# Altium project PCB_Project_Koruza_expander_board_Altium.PrjPcb
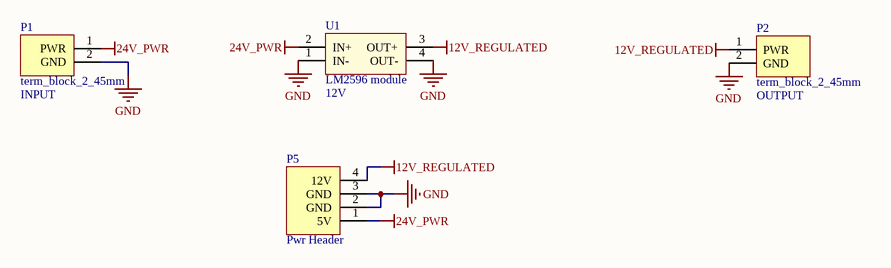
[diagram p0: Sheet1_PWR_connectors.SchDoc]
4 sheets, 70 parts. Net scope: flat (ports and power ports of the same name join across sheets).
Board file: PCB_Koruza_expander_board.PcbDoc
Sheets:
  Sheet1_PWR_connectors.SchDoc
  Sheet2_WITI_Board_USB.SchDoc
  Sheet3_IR.SchDoc
  Sheet4_SFP_StepperDriver.SchDoc

## Sheet Sheet1_PWR_connectors.SchDoc: Koruza Expander Board
size A4; Date: 12.7.2016; Author: Matej Gomboc; CompanyName: Institute IRNAS Rače; Revision: 1.0; SheetNumber: 1; SheetTotal: 4; CurrentDate: 12.7.2016

### Parts
P1  term_block_2_45mm  Direction: INPUT  [term_block_2_45mm]
P2  term_block_2_45mm  Direction: OUTPUT  [term_block_2_45mm]
P5  Pwr Header  [HDR1X4_CONN]
U1  LM2596 module  value 12V  [LM2596 module]

### Nets
12V_REGULATED: P2.1(PWR) P5.4(12V) U1.3(OUT+)
24V_PWR: P1.1(PWR) P5.1(5V) U1.2(IN+)
GND: P1.2(GND) P2.2(GND) P5.2(GND) P5.3(GND) U1.1(IN-) U1.4(OUT-)

### Library data of the parts
P1 P2 = term_block_2_45mm: terminal block, 2.45mm
P5 = 1x4_pwr_header: 1X4 Pwr Header

## Sheet Sheet2_WITI_Board_USB.SchDoc: Koruza Expander Board
size A4; Date: 12.7.2016; Author: Matej Gomboc; CompanyName: Institute IRNAS Rače; Revision: 1.0; SheetNumber: 2; SheetTotal: 4; CurrentDate: 12.7.2016
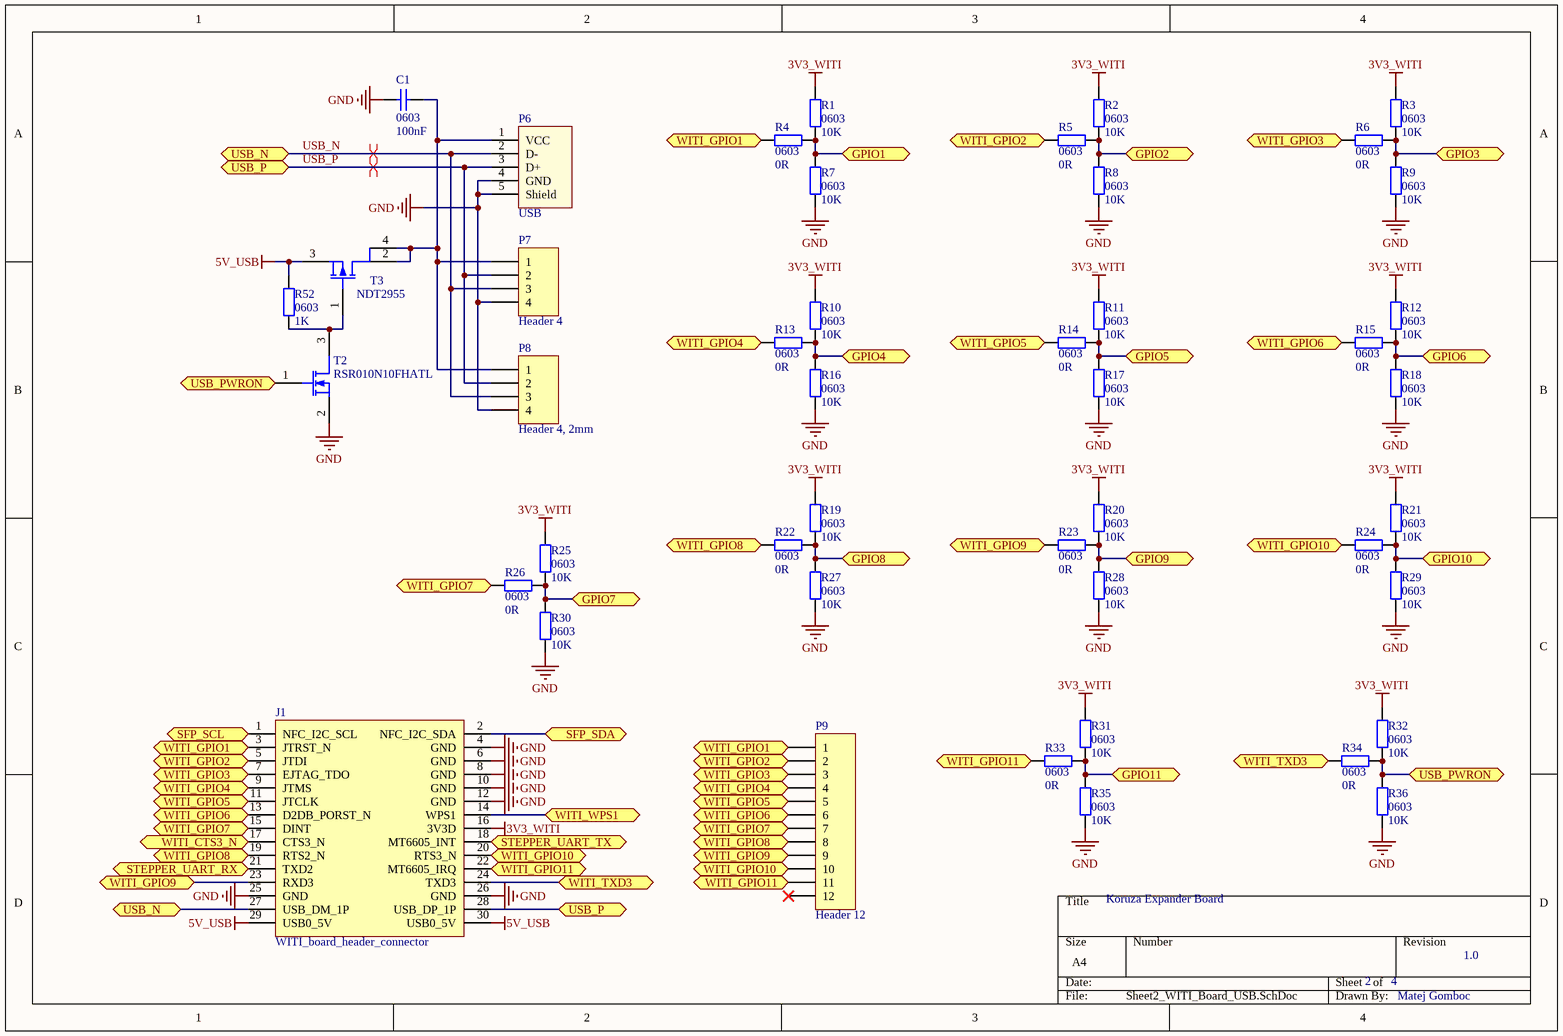
[diagram p1: Sheet2_WITI_Board_USB.SchDoc]

### Parts
C1  0603  value 100nF  [0603_HandSoldering]
J1  WITI_board_header_connector  [HDR2X15]
P6  USB  [USB A THT]
P7  Header 4  [HDR1X4]
P8  Header 4, 2mm  [HDR1X4_2mm]
P9  Header 12  [HDR1X12]
R1  0603  value 10K  [0603_HandSoldering]
R2  0603  value 10K  [0603_HandSoldering]
R3  0603  value 10K  [0603_HandSoldering]
R4  0603  value 0R  [0603_HandSoldering]
R5  0603  value 0R  [0603_HandSoldering]
R6  0603  value 0R  [0603_HandSoldering]
R7  0603  value 10K  [0603_HandSoldering]
R8  0603  value 10K  [0603_HandSoldering]
R9  0603  value 10K  [0603_HandSoldering]
R10  0603  value 10K  [0603_HandSoldering]
R11  0603  value 10K  [0603_HandSoldering]
R12  0603  value 10K  [0603_HandSoldering]
R13  0603  value 0R  [0603_HandSoldering]
R14  0603  value 0R  [0603_HandSoldering]
R15  0603  value 0R  [0603_HandSoldering]
R16  0603  value 10K  [0603_HandSoldering]
R17  0603  value 10K  [0603_HandSoldering]
R18  0603  value 10K  [0603_HandSoldering]
R19  0603  value 10K  [0603_HandSoldering]
R20  0603  value 10K  [0603_HandSoldering]
R21  0603  value 10K  [0603_HandSoldering]
R22  0603  value 0R  [0603_HandSoldering]
R23  0603  value 0R  [0603_HandSoldering]
R24  0603  value 0R  [0603_HandSoldering]
R25  0603  value 10K  [0603_HandSoldering]
R26  0603  value 0R  [0603_HandSoldering]
R27  0603  value 10K  [0603_HandSoldering]
R28  0603  value 10K  [0603_HandSoldering]
R29  0603  value 10K  [0603_HandSoldering]
R30  0603  value 10K  [0603_HandSoldering]
R31  0603  value 10K  [0603_HandSoldering]
R32  0603  value 10K  [0603_HandSoldering]
R33  0603  value 0R  [0603_HandSoldering]
R34  0603  value 0R  [0603_HandSoldering]
R35  0603  value 10K  [0603_HandSoldering]
R36  0603  value 10K  [0603_HandSoldering]
R52  0603  value 1K  [0603_HandSoldering]
T2  RSR010N10FHATL  [SOT23-3]
T3  NDT2955  [SOT230P700X180-4N]

### Ports
GPIO1, GPIO2, GPIO3, GPIO4, GPIO5, GPIO6, GPIO7, GPIO8, GPIO9, GPIO10, GPIO11, SFP_SCL, SFP_SDA, STEPPER_UART_RX, STEPPER_UART_TX, USB_N, USB_P, USB_PWRON, WITI_CTS3_N, WITI_GPIO1, WITI_GPIO2, WITI_GPIO3, WITI_GPIO4, WITI_GPIO5, WITI_GPIO6, WITI_GPIO7, WITI_GPIO8, WITI_GPIO9, WITI_GPIO10, WITI_GPIO11, WITI_TXD3, WITI_WPS1

### Nets
3V3_WITI: J1.16(3V3D) R1.2 R2.2 R3.2 R10.2 R11.2 R12.2 R19.2 R20.2 R21.2 R25.2 R31.2 R32.2
5V_USB: J1.29(USB0_5V) J1.30(USB0_5V) R52.2 T3.3(S)
GND: C1.1 J1.4(GND) J1.6(GND) J1.8(GND) J1.10(GND) J1.12(GND) J1.25(GND) J1.26(GND) P6.4(GND) P6.5(Shield) P7.4 P8.4 R7.1 R8.1 R9.1 R16.1 R17.1 R18.1 R27.1 R28.1 R29.1 R30.1 R35.1 R36.1 T2.2(S)
USB_N: J1.27(USB_DM_1P) P6.2(D-) P7.3 P8.3 ; port USB_N
USB_P: J1.28(USB_DP_1P) P6.3(D+) P7.2 P8.2 ; port USB_P
NetC1_2: C1.2 P6.1(VCC) P7.1 P8.1 T3.2(D) T3.4(D)
NetJ1_1: J1.1(NFC_I2C_SCL) ; port SFP_SCL
NetJ1_2: J1.2(NFC_I2C_SDA) ; port SFP_SDA
NetJ1_3: J1.3(JTRST_N) P9.1 R4.1 ; port WITI_GPIO1
NetJ1_5: J1.5(JTDI) P9.2 R5.1 ; port WITI_GPIO2
NetJ1_7: J1.7(EJTAG_TDO) P9.3 R6.1 ; port WITI_GPIO3
NetJ1_9: J1.9(JTMS) P9.4 R13.1 ; port WITI_GPIO4
NetJ1_11: J1.11(JTCLK) P9.5 R14.1 ; port WITI_GPIO5
NetJ1_13: J1.13(D2DB_PORST_N) P9.6 R15.1 ; port WITI_GPIO6
NetJ1_14: J1.14(WPS1) ; port WITI_WPS1
NetJ1_15: J1.15(DINT) P9.7 R26.1 ; port WITI_GPIO7
NetJ1_17: J1.17(CTS3_N) ; port WITI_CTS3_N
NetJ1_18: J1.18(MT6605_INT) ; port STEPPER_UART_TX
NetJ1_19: J1.19(RTS2_N) P9.8 R22.1 ; port WITI_GPIO8
NetJ1_20: J1.20(RTS3_N) P9.10 R24.1 ; port WITI_GPIO10
NetJ1_21: J1.21(TXD2) ; port STEPPER_UART_RX
NetJ1_22: J1.22(MT6605_IRQ) P9.11 R33.1 ; port WITI_GPIO11
NetJ1_23: J1.23(RXD3) P9.9 R23.1 ; port WITI_GPIO9
NetJ1_24: J1.24(TXD3) R34.1 ; port WITI_TXD3
NetR1_1: R1.1 R4.2 R7.2 ; port GPIO1
NetR2_1: R2.1 R5.2 R8.2 ; port GPIO2
NetR3_1: R3.1 R6.2 R9.2 ; port GPIO3
NetR10_1: R10.1 R13.2 R16.2 ; port GPIO4
NetR11_1: R11.1 R14.2 R17.2 ; port GPIO5
NetR12_1: R12.1 R15.2 R18.2 ; port GPIO6
NetR19_1: R19.1 R22.2 R27.2 ; port GPIO8
NetR20_1: R20.1 R23.2 R28.2 ; port GPIO9
NetR21_1: R21.1 R24.2 R29.2 ; port GPIO10
NetR25_1: R25.1 R26.2 R30.2 ; port GPIO7
NetR31_1: R31.1 R33.2 R35.2 ; port GPIO11
NetR32_1: R32.1 R34.2 R36.2 T2.1(G) ; port USB_PWRON
NetR52_1: R52.1 T2.3(D) T3.1(G)

Not connected (* = marked no-connect by the designer): P9 12*

### Layout directives
differential pair: USB_N, USB_P

### Library data of the parts
C1 = capacitor_ceramic: Ceramic Capacitor
J1 = WITI_board_header_connector: WITI board header connector
P6 = USB: USB A standard receptacle
P7 = Header 4: Header, 4-Pin
P8 = Header 4 - 2mm: Header, 4-Pin, 2mm
P9 = Header 12: Header, 12-Pin
R1-R36 R52 = resistor
T2 = RSR010N10FHATL: N MOSFET
T3 = NDT2955: P MOSFET

## Sheet Sheet3_IR.SchDoc: Koruza Expander Board
size A4; Date: 12.7.2016; Author: Matej Gomboc; CompanyName: Institute IRNAS Rače; Revision: 1.0; SheetNumber: 3; SheetTotal: 4; CurrentDate: 12.7.2016
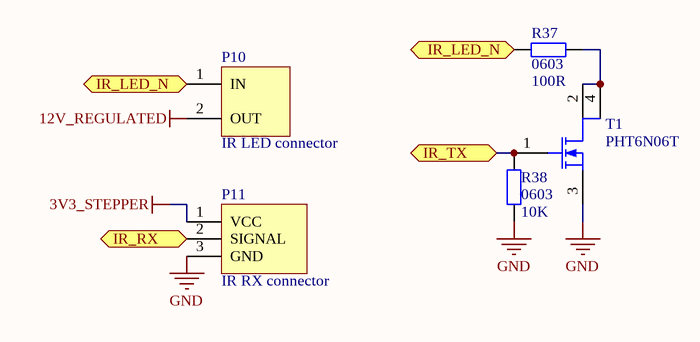
[diagram p2: Sheet3_IR.SchDoc]

### Parts
P10  IR LED connector  [term_block_2_45mm]
P11  IR RX connector  [term_block_3pole_2_45mm]
R37  0603  value 100R  [0603_HandSoldering]
R38  0603  value 10K  [0603_HandSoldering]
T1  PHT6N06T  [SOT230P700X180-4N]

### Ports
IR_LED_N, IR_RX, IR_TX

### Nets
3V3_STEPPER: P11.1(VCC)
12V_REGULATED: P10.2(OUT)
GND: P11.3(GND) R38.1 T1.3(S)
NetP10_1: P10.1(IN) R37.2 ; port IR_LED_N
NetP11_2: P11.2(SIGNAL) ; port IR_RX
NetR37_1: R37.1 T1.2(D) T1.4(D)
NetR38_2: R38.2 T1.1(G) ; port IR_TX

### Library data of the parts
P10 = IR_LED_connector
P11 = IR_RX_connector
R37 R38 = resistor
T1 = PHT6N06T: N MOSFET

## Sheet Sheet4_SFP_StepperDriver.SchDoc: Koruza Expander Board
size A4; Date: 12.7.2016; Author: Matej Gomboc; CompanyName: Institute IRNAS Rače; Revision: 1.0; SheetNumber: 4; SheetTotal: 4; CurrentDate: 12.7.2016
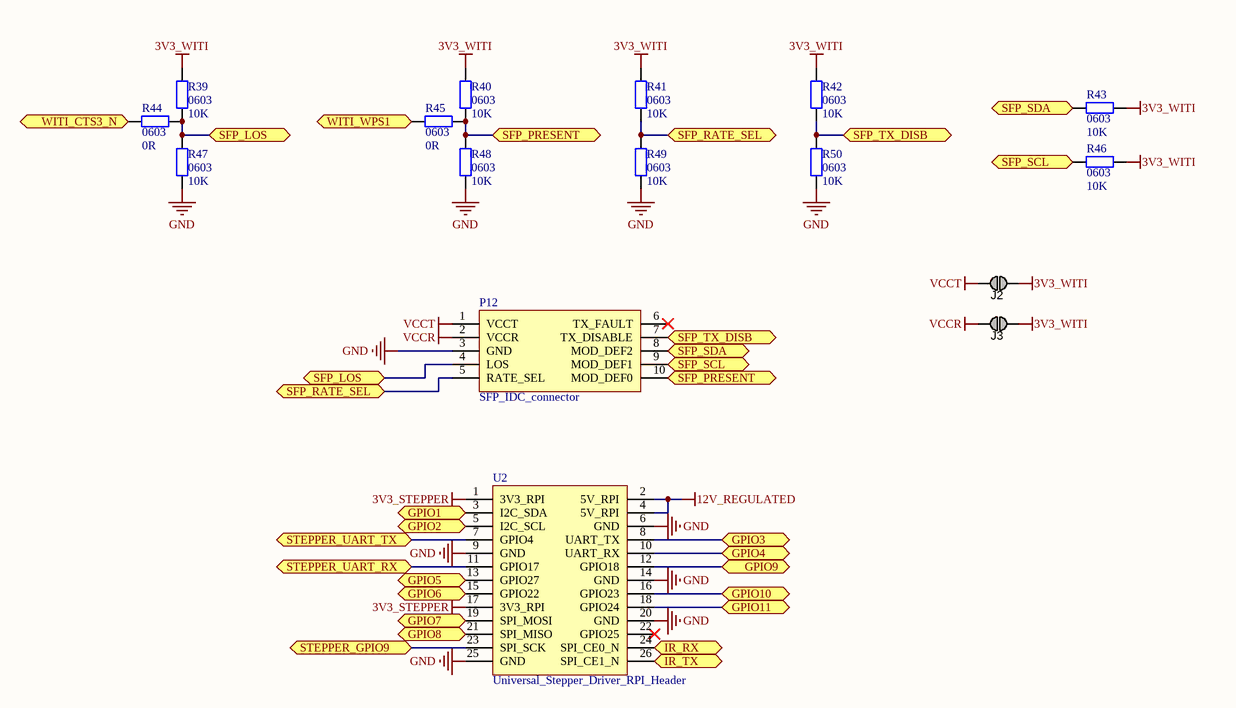
[diagram p3: Sheet4_SFP_StepperDriver.SchDoc]

### Parts
J2  Jumper  [JUMP1]  (value not drawn)  (no BOM)
J3  Jumper  [JUMP1]  (value not drawn)  (no BOM)
P12  SFP_IDC_connector  [IDC10]
R39  0603  value 10K  [0603_HandSoldering]
R40  0603  value 10K  [0603_HandSoldering]
R41  0603  value 10K  [0603_HandSoldering]
R42  0603  value 10K  [0603_HandSoldering]
R43  0603  value 10K  [0603_HandSoldering]
R44  0603  value 0R  [0603_HandSoldering]
R45  0603  value 0R  [0603_HandSoldering]
R46  0603  value 10K  [0603_HandSoldering]
R47  0603  value 10K  [0603_HandSoldering]
R48  0603  value 10K  [0603_HandSoldering]
R49  0603  value 10K  [0603_HandSoldering]
R50  0603  value 10K  [0603_HandSoldering]
U2  Universal_Stepper_Driver_RPI_Header  [Universal_Stepper_Driver_board]

### Ports
GPIO1, GPIO2, GPIO3, GPIO4, GPIO5, GPIO6, GPIO7, GPIO8, GPIO9, GPIO10, GPIO11, IR_RX, IR_TX, SFP_LOS, SFP_PRESENT, SFP_RATE_SEL, SFP_SCL, SFP_SDA, SFP_TX_DISB, STEPPER_GPIO9, STEPPER_UART_RX, STEPPER_UART_TX, WITI_CTS3_N, WITI_WPS1

### Nets
3V3_STEPPER: U2.1(3V3_RPI) U2.17(3V3_RPI)
3V3_WITI: J2.1 J3.2 R39.2 R40.2 R41.2 R42.2 R43.1 R46.1
12V_REGULATED: U2.2(5V_RPI) U2.4(5V_RPI)
GND: P12.3(GND) R47.1 R48.1 R49.1 R50.1 U2.6(GND) U2.9(GND) U2.14(GND) U2.20(GND) U2.25(GND)
VCCR: J3.1 P12.2(VCCR)
VCCT: J2.2 P12.1(VCCT)
NetJ1_1: P12.9(MOD_DEF1) R46.2 ; port SFP_SCL
NetJ1_2: P12.8(MOD_DEF2) R43.2 ; port SFP_SDA
NetJ1_14: R45.1 ; port WITI_WPS1
NetJ1_17: R44.1 ; port WITI_CTS3_N
NetJ1_18: U2.7(GPIO4) ; port STEPPER_UART_TX
NetJ1_21: U2.11(GPIO17) ; port STEPPER_UART_RX
NetP11_2: U2.24(SPI_CE0_N) ; port IR_RX
NetP12_4: P12.4(LOS) R39.1 R44.2 R47.2 ; port SFP_LOS
NetP12_5: P12.5(RATE_SEL) R41.1 R49.2 ; port SFP_RATE_SEL
NetP12_7: P12.7(TX_DISABLE) R42.1 R50.2 ; port SFP_TX_DISB
NetP12_10: P12.10(MOD_DEF0) R40.1 R45.2 R48.2 ; port SFP_PRESENT
NetR1_1: U2.3(I2C_SDA) ; port GPIO1
NetR2_1: U2.5(I2C_SCL) ; port GPIO2
NetR3_1: U2.8(UART_TX) ; port GPIO3
NetR10_1: U2.10(UART_RX) ; port GPIO4
NetR11_1: U2.13(GPIO27) ; port GPIO5
NetR12_1: U2.15(GPIO22) ; port GPIO6
NetR19_1: U2.21(SPI_MISO) ; port GPIO8
NetR20_1: U2.12(GPIO18) ; port GPIO9
NetR21_1: U2.16(GPIO23) ; port GPIO10
NetR25_1: U2.19(SPI_MOSI) ; port GPIO7
NetR31_1: U2.18(GPIO24) ; port GPIO11
NetR38_2: U2.26(SPI_CE1_N) ; port IR_TX
NetU2_23: U2.23(SPI_SCK) ; port STEPPER_GPIO9

Not connected (* = marked no-connect by the designer): P12 6(TX_FAULT)*; U2 22(GPIO25)*

### Library data of the parts
J2 J3 = JUMP1: SMD jumper
P12 = SFP_IDC_connector: SFP IDC10 connector
R39-R50 = resistor
U2 = Universal_Stepper_Driver: Universal Stepper Driver Raspberry PI Header

## Nets that join several sheets
3V3_STEPPER: Sheet3_IR (P11.1), Sheet4_SFP_StepperDriver (U2.1 U2.17)
3V3_WITI: Sheet2_WITI_Board_USB (13 pins), Sheet4_SFP_StepperDriver (8 pins)
12V_REGULATED: Sheet1_PWR_connectors (P2.1 P5.4 U1.3), Sheet3_IR (P10.2), Sheet4_SFP_StepperDriver (U2.2 U2.4)
GND: Sheet1_PWR_connectors (6 pins), Sheet2_WITI_Board_USB (25 pins), Sheet3_IR (P11.3 R38.1 T1.3), Sheet4_SFP_StepperDriver (10 pins)
NetJ1_1: Sheet2_WITI_Board_USB (J1.1), Sheet4_SFP_StepperDriver (P12.9 R46.2)
NetJ1_2: Sheet2_WITI_Board_USB (J1.2), Sheet4_SFP_StepperDriver (P12.8 R43.2)
NetJ1_14: Sheet2_WITI_Board_USB (J1.14), Sheet4_SFP_StepperDriver (R45.1)
NetJ1_17: Sheet2_WITI_Board_USB (J1.17), Sheet4_SFP_StepperDriver (R44.1)
NetJ1_18: Sheet2_WITI_Board_USB (J1.18), Sheet4_SFP_StepperDriver (U2.7)
NetJ1_21: Sheet2_WITI_Board_USB (J1.21), Sheet4_SFP_StepperDriver (U2.11)
NetP11_2: Sheet3_IR (P11.2), Sheet4_SFP_StepperDriver (U2.24)
NetR1_1: Sheet2_WITI_Board_USB (R1.1 R4.2 R7.2), Sheet4_SFP_StepperDriver (U2.3)
NetR2_1: Sheet2_WITI_Board_USB (R2.1 R5.2 R8.2), Sheet4_SFP_StepperDriver (U2.5)
NetR3_1: Sheet2_WITI_Board_USB (R3.1 R6.2 R9.2), Sheet4_SFP_StepperDriver (U2.8)
NetR10_1: Sheet2_WITI_Board_USB (R10.1 R13.2 R16.2), Sheet4_SFP_StepperDriver (U2.10)
NetR11_1: Sheet2_WITI_Board_USB (R11.1 R14.2 R17.2), Sheet4_SFP_StepperDriver (U2.13)
NetR12_1: Sheet2_WITI_Board_USB (R12.1 R15.2 R18.2), Sheet4_SFP_StepperDriver (U2.15)
NetR19_1: Sheet2_WITI_Board_USB (R19.1 R22.2 R27.2), Sheet4_SFP_StepperDriver (U2.21)
NetR20_1: Sheet2_WITI_Board_USB (R20.1 R23.2 R28.2), Sheet4_SFP_StepperDriver (U2.12)
NetR21_1: Sheet2_WITI_Board_USB (R21.1 R24.2 R29.2), Sheet4_SFP_StepperDriver (U2.16)
NetR25_1: Sheet2_WITI_Board_USB (R25.1 R26.2 R30.2), Sheet4_SFP_StepperDriver (U2.19)
NetR31_1: Sheet2_WITI_Board_USB (R31.1 R33.2 R35.2), Sheet4_SFP_StepperDriver (U2.18)
NetR38_2: Sheet3_IR (R38.2 T1.1), Sheet4_SFP_StepperDriver (U2.26)